# Altium schematic sheet CON_MC_XMC_J12_64PIN.SchDoc
size A4
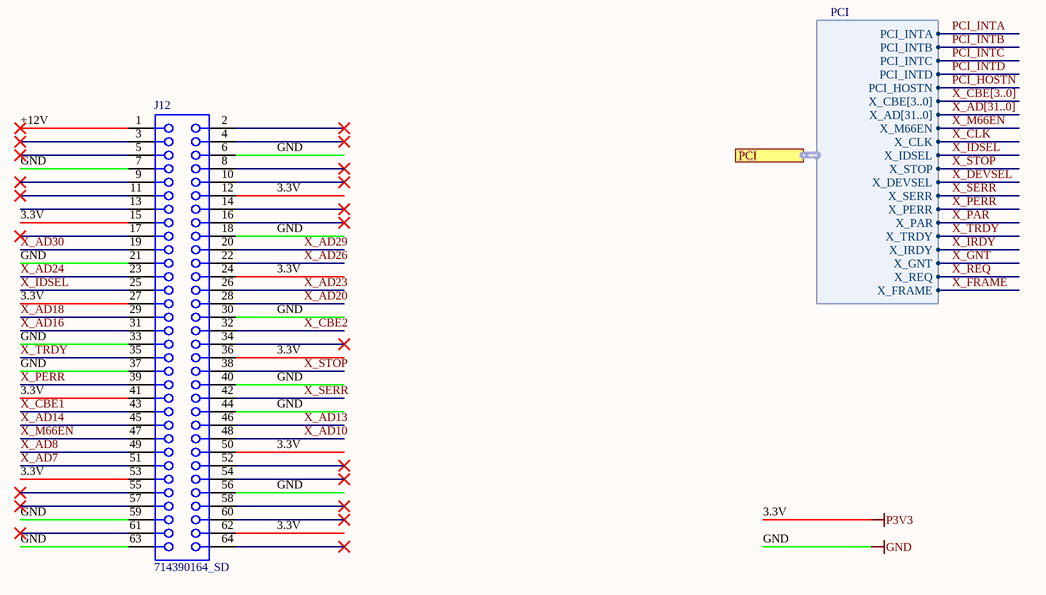
[diagram p0: CON_MC_XMC_J12_64PIN.SchDoc]

## Parts
J12  714390164_SD  [BTB1-2V64F]

## Ports
PCI (harness PCI)

## Harnesses
PCI: PCI_INTA, PCI_INTB, PCI_INTC, PCI_INTD, PCI_HOSTN, X_CBE[3..0], X_AD[31..0], X_M66EN, X_CLK, X_IDSEL, X_STOP, X_DEVSEL, X_SERR, X_PERR, X_PAR, X_TRDY, X_IRDY, X_GNT, X_REQ, X_FRAME

## Nets
3.3V: J12.12 J12.15 J12.24 J12.27 J12.36 J12.41 J12.50 J12.53 J12.62  [also labelled P3V3]
GND: J12.6 J12.7 J12.18 J12.21 J12.30 J12.33 J12.37 J12.40 J12.44 J12.56 J12.59 J12.63
+12V: J12.1
PCI_HOSTN: port PCI.PCI_HOSTN
PCI_INTA: port PCI.PCI_INTA
PCI_INTB: port PCI.PCI_INTB
PCI_INTC: port PCI.PCI_INTC
PCI_INTD: port PCI.PCI_INTD
X_AD7: J12.51
X_AD8: J12.49
X_AD10: J12.48
X_AD13: J12.46
X_AD14: J12.45
X_AD16: J12.31
X_AD18: J12.29
X_AD20: J12.28
X_AD23: J12.26
X_AD24: J12.23
X_AD26: J12.22
X_AD29: J12.20
X_AD30: J12.19
X_CBE1: J12.43
X_CBE2: J12.32
X_CLK: port PCI.X_CLK
X_DEVSEL: port PCI.X_DEVSEL
X_FRAME: port PCI.X_FRAME
X_GNT: port PCI.X_GNT
X_IDSEL: J12.25 ; port PCI.X_IDSEL
X_IRDY: port PCI.X_IRDY
X_M66EN: J12.47 ; port PCI.X_M66EN
X_PAR: port PCI.X_PAR
X_PERR: J12.39 ; port PCI.X_PERR
X_REQ: port PCI.X_REQ
X_SERR: J12.42 ; port PCI.X_SERR
X_STOP: J12.38 ; port PCI.X_STOP
X_TRDY: J12.35 ; port PCI.X_TRDY

Not connected (* = marked no-connect by the designer): J12 2* 3* 4* 5* 8* 9* 10* 11* 13 14* 16* 17* 34* 52* 54* 55* 57* 58* 60* 61* 64*

## Buses and harness runs
bus X_AD[31..0]
bus X_CBE[3..0]

## Library data of the parts
J12 = CMP-0001-00081-1: Board-to-Board Connector, Vertical, 2-Row, Pitch 1mm, 64-Position, Female; Mating Connector: Molex-714360164; ClassName: Board Template Connector; Datasheet Version: Apr-2006; Package Reference: BTB1-2V64F; Publisher: Altium; Component Kind: Standard